# Altium schematic sheet ROM.SchDoc
size A3; PageSetup: Record=PageOptions|CenterHorizontal=True|CenterVertical=True|PrintScale=0.73|XCorrection=1.00|YCorrection=1.00|PrintKind=0|BorderSize=5000000|LeftOffset=0|BottomOffset=0|Orientation=2|PaperLength=1000|PaperWidth=1000|Scale=100|PaperSource=7|PrintQuality=-3|MediaType=1|DitherType=10|PrintScaleMode=1|PaperKind=A4|PaperIndex=9
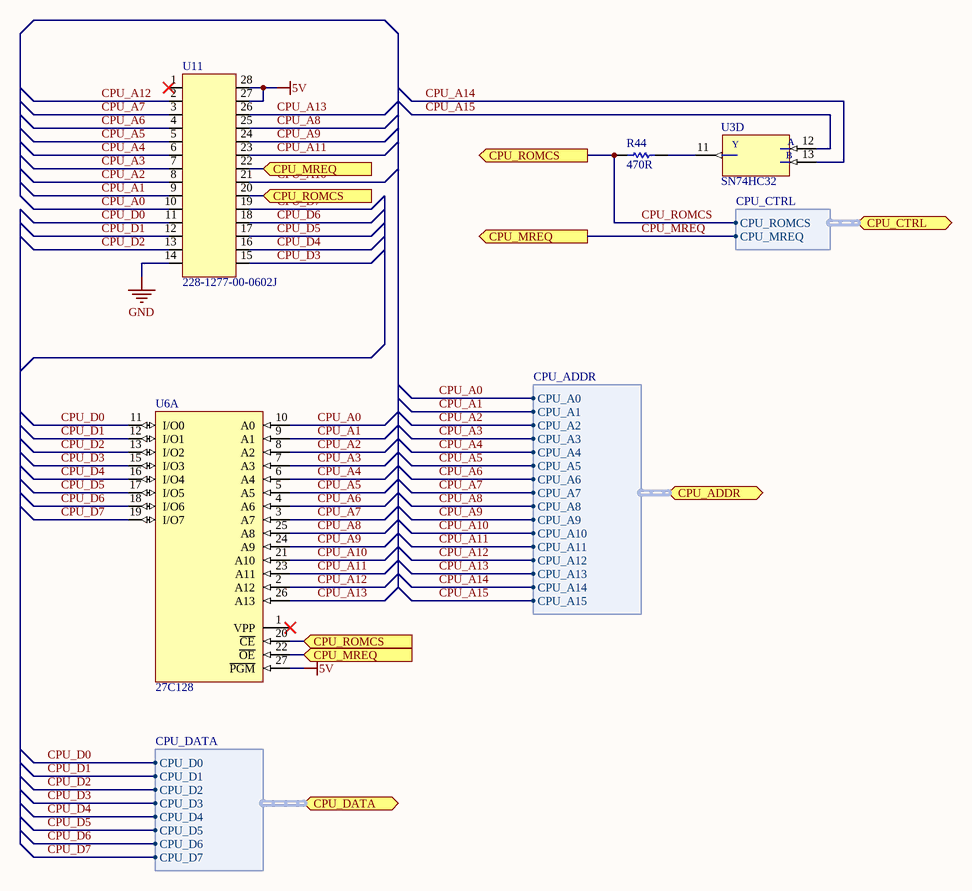
[diagram p0: ROM.SchDoc]

## Parts
R44  470R  [0805]
U3  SN74HC32  [SOIC14]  (part D of 5)
U6  27C128  [PDIP28]  (part A of 2)
U11  228-1277-00-0602J  [228-1277-00-0602J]

## Ports
CPU_ADDR (harness CPU_ADDR), CPU_CTRL (harness CPU_CTRL), CPU_DATA (harness CPU_DATA), CPU_MREQ (in), CPU_MREQ (out), CPU_ROMCS (in), CPU_ROMCS (out)

## Harnesses
CPU_DATA: CPU_D0, CPU_D1, CPU_D2, CPU_D3, CPU_D4, CPU_D5, CPU_D6, CPU_D7
CPU_ADDR: CPU_A0, CPU_A1, CPU_A2, CPU_A3, CPU_A4, CPU_A5, CPU_A6, CPU_A7, CPU_A8, CPU_A9, CPU_A10, CPU_A11, CPU_A12, CPU_A13, CPU_A14, CPU_A15
CPU_CTRL: CPU_MREQ, CPU_ROMCS

## Nets
5V: U6.27(~{PGM}) U11.27 U11.28
GND: U11.14
CPU_A0: U6.10(A0) U11.10 ; port CPU_ADDR.CPU_A0
CPU_A1: U6.9(A1) U11.9 ; port CPU_ADDR.CPU_A1
CPU_A2: U6.8(A2) U11.8 ; port CPU_ADDR.CPU_A2
CPU_A3: U6.7(A3) U11.7 ; port CPU_ADDR.CPU_A3
CPU_A4: U6.6(A4) U11.6 ; port CPU_ADDR.CPU_A4
CPU_A5: U6.5(A5) U11.5 ; port CPU_ADDR.CPU_A5
CPU_A6: U6.4(A6) U11.4 ; port CPU_ADDR.CPU_A6
CPU_A7: U6.3(A7) U11.3 ; port CPU_ADDR.CPU_A7
CPU_A8: U6.25(A8) U11.25 ; port CPU_ADDR.CPU_A8
CPU_A9: U6.24(A9) U11.24 ; port CPU_ADDR.CPU_A9
CPU_A10: U6.21(A10) U11.21 ; port CPU_ADDR.CPU_A10
CPU_A11: U6.23(A11) U11.23 ; port CPU_ADDR.CPU_A11
CPU_A12: U6.2(A12) U11.2 ; port CPU_ADDR.CPU_A12
CPU_A13: U6.26(A13) U11.26 ; port CPU_ADDR.CPU_A13
CPU_A14: U3.13(B) ; port CPU_ADDR.CPU_A14
CPU_A15: U3.12(A) ; port CPU_ADDR.CPU_A15
CPU_D0: U6.11(I/O0) U11.11 ; port CPU_DATA.CPU_D0
CPU_D1: U6.12(I/O1) U11.12 ; port CPU_DATA.CPU_D1
CPU_D2: U6.13(I/O2) U11.13 ; port CPU_DATA.CPU_D2
CPU_D3: U6.15(I/O3) U11.15 ; port CPU_DATA.CPU_D3
CPU_D4: U6.16(I/O4) U11.16 ; port CPU_DATA.CPU_D4
CPU_D5: U6.17(I/O5) U11.17 ; port CPU_DATA.CPU_D5
CPU_D6: U6.18(I/O6) U11.18 ; port CPU_DATA.CPU_D6
CPU_D7: U6.19(I/O7) U11.19 ; port CPU_DATA.CPU_D7
CPU_MREQ: U6.22(~{OE}) U11.22 ; port CPU_MREQ, port CPU_CTRL.CPU_MREQ
CPU_ROMCS: R44.2 U6.20(~{CE}) U11.20 ; port CPU_ROMCS, port CPU_CTRL.CPU_ROMCS
NetR44_1: R44.1 U3.11(Y)

Not connected (* = marked no-connect by the designer): U6 1(VPP)*; U11 1*

## Library data of the parts
R44 = Resistor
U3 = SN74HC32: Quadruple 2-Input Positive-OR Gates
U6 = 27C128: 128K (16K x 8) CMOS EPROM
U11 = 228-1277-00-0602J: DIP Sockets - 28 Pins